# EAGLE design 405_led_jetracer010002 (EAGLE 9.6.2)
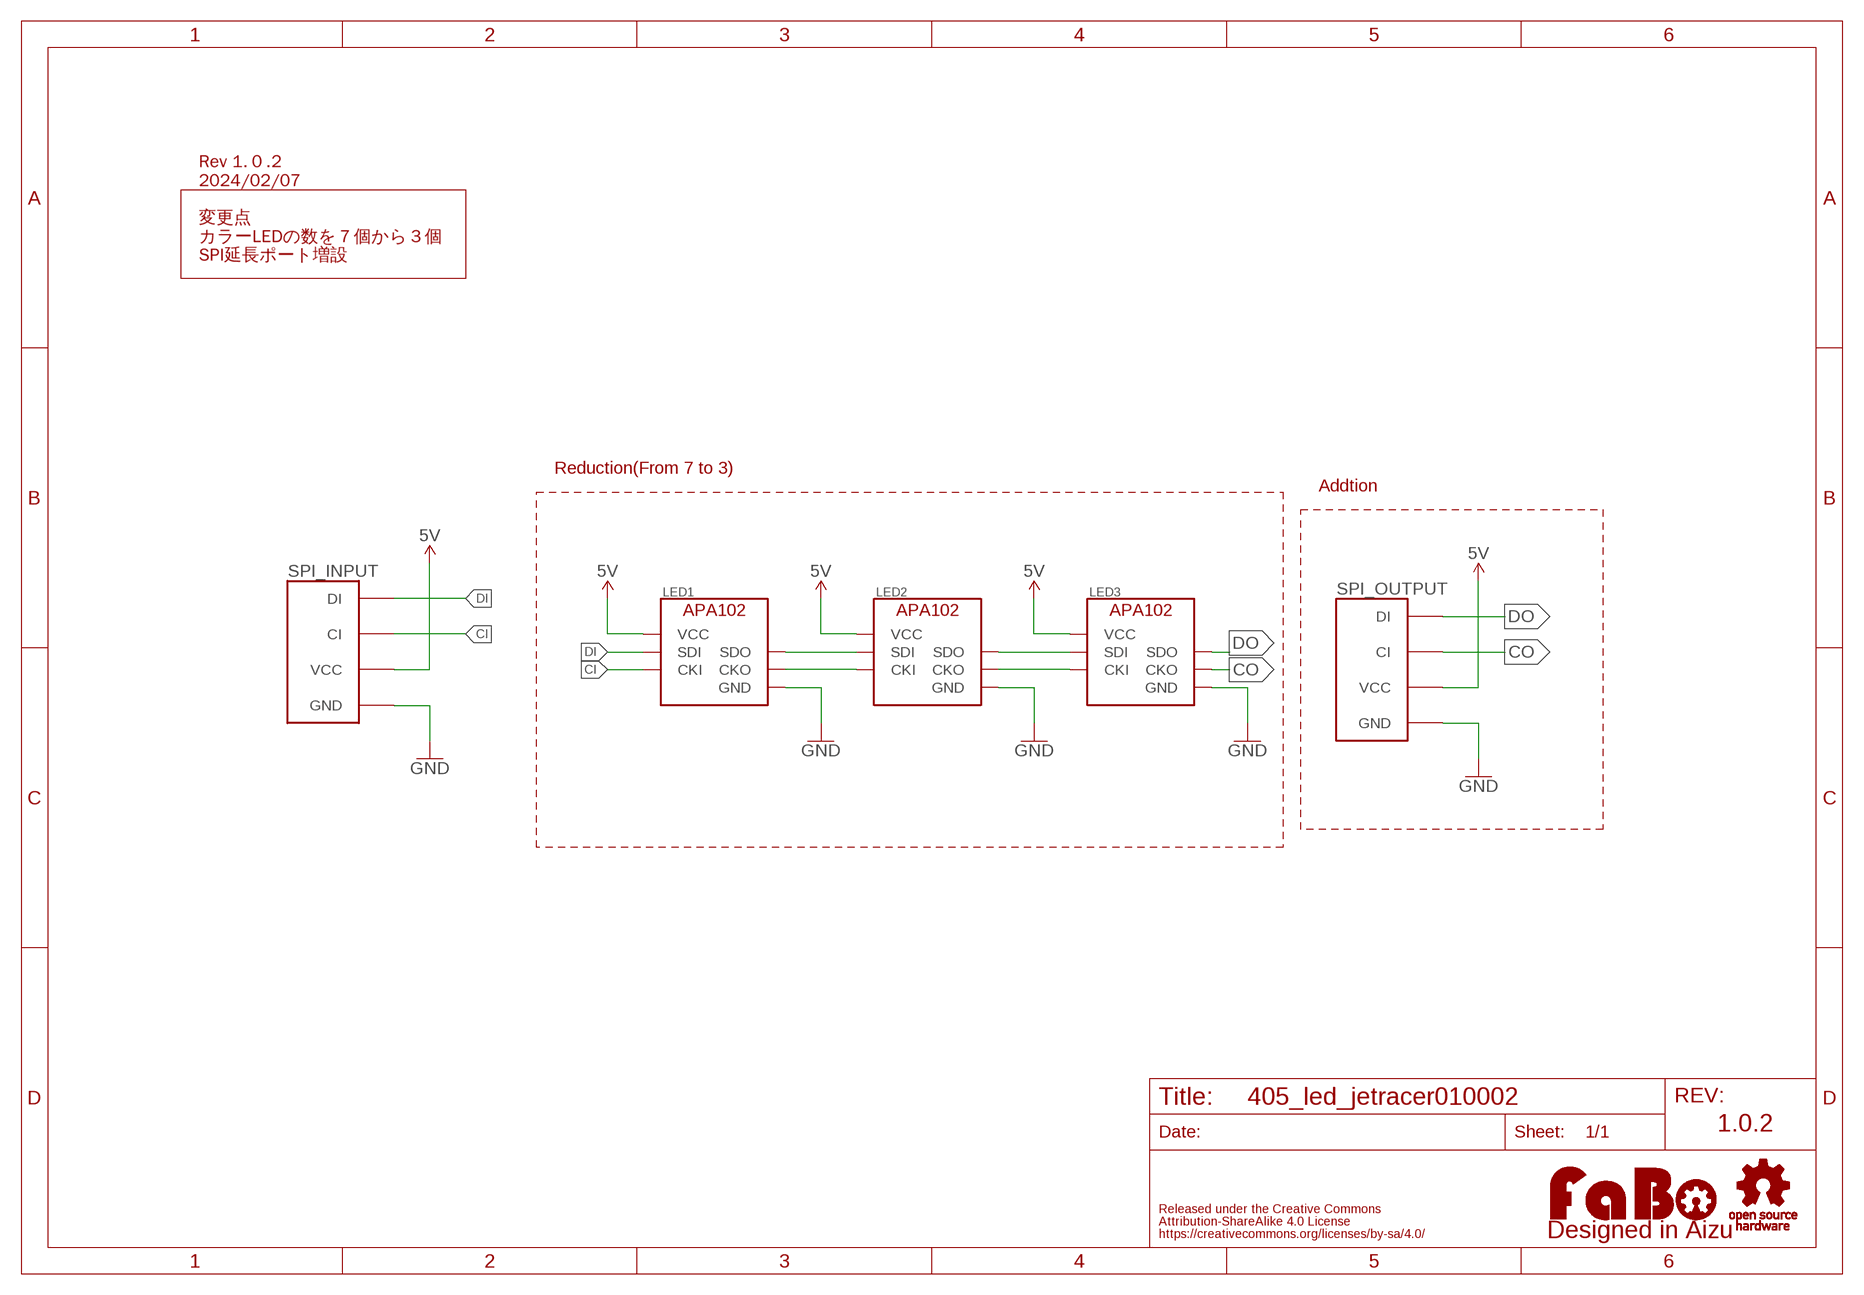
[diagram p0: schematic, sheet 1]

## Parts
LED1  APA102_IPIXEL  [APA102_2020]
LED2  APA102_IPIXEL  [APA102_2020]
LED3  APA102_IPIXEL  [APA102_2020]
LOGO1  LOGO_OSHW-S_BOTTOM  [LOGO_OSHW_S_BOTTOM]
LOGO2  LOGO_FABO-S  [LOGO_FABO_S]
SPI_INPUT  FABO-SPI-LED-B04B  [SPI-B04B-PASK-1]
SPI_OUTPUT  FABO-SPI-LED-B04B  [SPI-B04B-PASK-1]

## Nets
5V: LED1.VCC LED2.VCC LED3.VCC SPI_INPUT.VCC SPI_OUTPUT.VCC
CI: LED1.CKI SPI_INPUT.CI
CI1: LED1.CKO LED2.CKI
CI2: LED2.CKO LED3.CKI
CO: LED3.CKO SPI_OUTPUT.CI
DI: LED1.SDI SPI_INPUT.DI
DI1: LED1.SDO LED2.SDI
DI2: LED2.SDO LED3.SDI
DO: LED3.SDO SPI_OUTPUT.DI
GND: LED1.GND LED2.GND LED3.GND SPI_INPUT.GND SPI_OUTPUT.GND

## Notes on the sheet
- Rev 1.０.2
  2024/02/07
  
  変更点
  カラーLEDの数を７個から３個
  SPI延長ポート増設
- Reduction(From 7 to 3)
- Addtion
- 1.0.2

## Library data of the parts
LED1-LED3 = FaBo-LED:APA102
LOGO1 = FaBo-Logo:LOGO_OSHW
LOGO2 = FaBo-Logo:LOGO_FABO
SPI_INPUT SPI_OUTPUT = FaBo-Connetor:FABO-SPI-LED

## Board
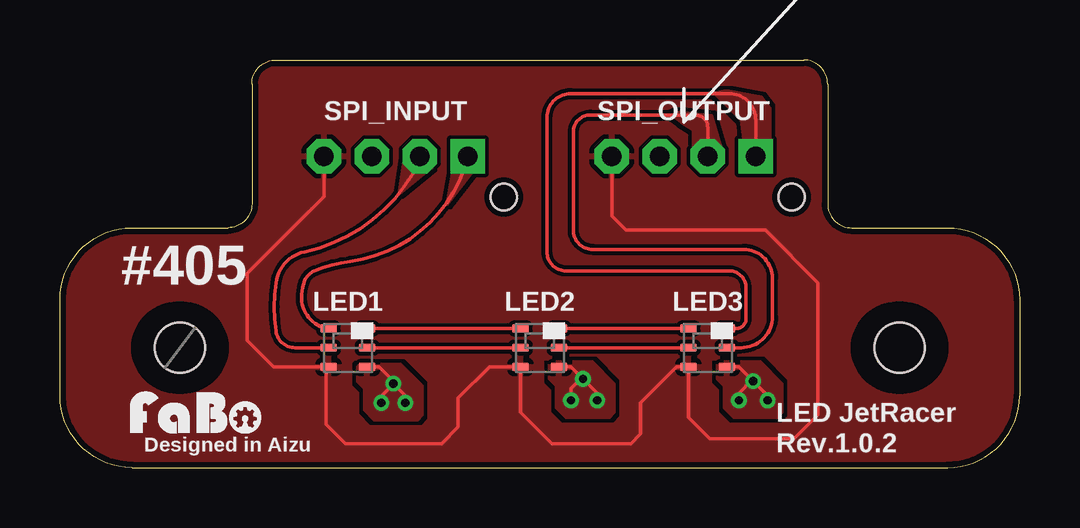
[diagram p1: board, top side]
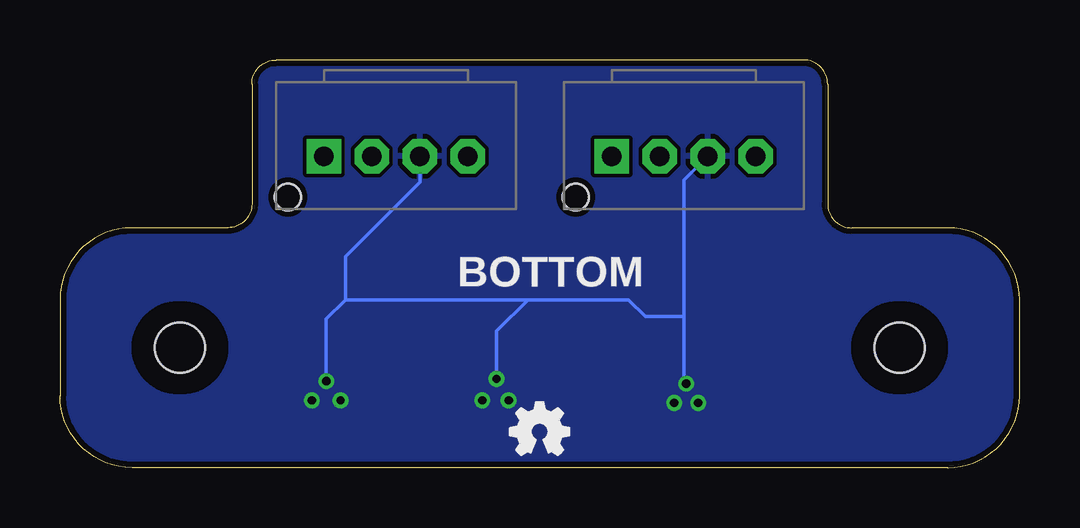
[diagram p2: board, bottom side, seen from below]

Size 40 x 17 mm. Coordinates in mm from the lower left corner, seen from the top.
Outline: 3,0 37,0 arc90 40,3 40,7 arc90 37,10 33,10 arc-90 32,11 32,16 arc90 31,17 9,17 arc90 8,16 8,11 arc-90 7,10 3,10 arc90 0,7 0,3 arc90 3,0
Copper layers (1*16): Top 0.035mm / dielectric 1.6mm / Bottom 0.035mm
Design rules "PCBway": minimum track width 6mil, minimum drill 12mil, track to track 6mil, track to pad 6mil, pad to pad 6mil, via to via 6mil, smd to smd 6mil, copper to edge 10mil, drill to drill 10mil, minimum pad ring 10mil, minimum via ring 6mil, stop-mask expansion 2mil, vias tented up to drill 100mil, thermal gap 8mil
Holes 2.1 mm at 5,5 35,5
tRestrict: area 3.2,3.3 to 6.8,6.7; area 33.2,3.3 to 36.8,6.7
bRestrict: area 3.2,3.3 to 6.8,6.7; area 33.2,3.3 to 36.8,6.7

### Footprints (pad centres in the part's own frame; a part is rotated, then mirrored left to right if it is on the bottom)
APA102_2020 = smd 0.7 x 0.35: CKI 0.8,0; CKO -0.8,0; GND 0.8,0.8; SDI 0.8,-0.8; SDO -0.8,-0.8; VCC -0.8,0.8
SPI-B04B-PASK-1 = drill 0.8 pad 1.422 octagon: CI 1,1.27; GND -3,1.27; VCC -1,1.27 | drill 0.8 pad 1.422 square: DI 3,1.27 | hole 1.1: 4.5,2.97

### Placement (x,y rotation side)
LED1  12,5 180 top
LED2  20,5 180 top
LED3  27,5 180 top
LOGO1  20,1.5 0 top
LOGO2  5.71,1.27 0 top
SPI_INPUT  14,14.25 180 bottom
SPI_OUTPUT  26,14.25 180 bottom

### Tracks (layer width: path | path; a pad name or v marks a point on that pad's centre or on a via)
5V  (via drill 0.35)
  Top 0.152: LED1.VCC 13.3,4.2 13.9,3.6 v13.9,3.5 | LED2.VCC 21.3,4.2 21.75,3.75 | 21.75,3.75 v21.8,3.7 22.4,3.1 v22.4,2.8 | LED3.VCC 28.3,4.2 28.85,3.65 | 28.85,3.65 v28.9,3.6 29.5,3 v29.5,2.8 | v13.4,2.7 13.4,3 v13.9,3.5 | v13.9,3.5 14.4,3 v14.4,2.7 | v21.3,2.8 21.3,3.3 21.75,3.75 | v28.3,2.8 28.3,3.1 28.85,3.65
  Bottom 0.152: SPI_INPUT.VCC 14,11.98 14,6.3 | 14,6.3 14,3.6 v13.9,3.5 | 14,6.3 15.6,6.3 16.3,7 20.5,7 | 20.5,7 21.8,5.7 v21.8,3.7 | 20.5,7 28.1,7 | 28.1,7 28.9,6.2 v28.9,3.6 | SPI_OUTPUT.VCC 25,11.9 28.1,8.8 28.1,7
  pour Bottom (isolate 0.152, rank 3): -2.5,-1.8 42.6,-1.8 42.6,19.4 -2.5,19.4
  pour Top: 12.7,2.4 12.7,3.3 12.4,3.6 12.4,4.2 12.5,4.3 14.2,4.3 15.1,3.4 15.1,2.2 14.9,2 13.1,2
  pour Top: 20.7,2.5 20.7,3.4 20.4,3.7 20.4,4.3 20.5,4.4 22.2,4.4 23.1,3.5 23.1,2.3 22.9,2.1 21.1,2.1
  pour Top: 27.7,2.5 27.7,3.4 27.4,3.7 27.4,4.3 27.5,4.4 29.2,4.4 30.1,3.5 30.1,2.3 29.9,2.1 28.1,2.1
CI
  Top 0.152: SPI_INPUT.CI 15,12.8 arc-52 10.2,9 arc70 9,7.7 arc15 9,5.7 arc82 9.8,5 LED1.CKI
  pour Top (no thermals): 14.13,11.41 14.4,13.2 14.8,13.6 15.2,13.6 15.5,13.3 15.5,12.54
CI1
  Top 0.152: LED1.CKO LED2.CKI
CI2
  Top 0.152: LED2.CKO LED3.CKI
CO
  Top 0.152: LED3.CKO 28.4,5 arc90 29.7,6.3 29.7,7.9 arc90 28.5,9.1 22.2,9.1 arc-90 21.4,9.9 21.4,14 arc-90 22.1,14.7 26.5,14.7 | 26.5,14.7 26.6,14.7 | 26.5,14.7 arc-90 27,14.2 SPI_OUTPUT.CI
  pour Top (no thermals): 26.4,12.8 26.4,14.1 25.9,14.4 25.5,14.7 25.81,14.83 27.16,14.68 27.6,13.2 27.6,12.8 27.2,12.6 26.7,12.6
DI
  Top 0.152: LED1.SDI arc-76 10.08,6.92 arc-29 10.2,7.8 arc-45 10.6,8.2 arc-15 12.1,8.6 arc68 SPI_INPUT.DI
  pour Top (no thermals): 16.13,10.97 16.56,13.29 17.47,13.38 17.63,12.91
DI1
  Top 0.152: LED1.SDO LED2.SDI
DI2
  Top 0.152: LED2.SDO LED3.SDI
DO
  Top 0.152: SPI_OUTPUT.DI 29,14.5 arc90 27.9,15.6 21.3,15.6 arc90 20.3,14.6 20.3,9 arc90 21.1,8.2 27.9,8.2 arc-90 28.6,7.5 28.6,6.2 arc-90 28.2,5.8 LED3.SDO
  pour Top (no thermals): 28.66,12.58 28.4,14.5 27.28,15.62 27.77,15.71 29.24,15.45 29.6,15 29.6,12.83 29.4,12.5 28.72,12.5
GND
  Top 0.152: SPI_INPUT.GND 11,11.3 7.8,8.1 7.8,5.3 8.9,4.2 LED1.GND 11.1,4.1 11.1,1.8 11.9,1 15.9,1 16.6,1.7 16.6,2.9 17.9,4.2 LED2.GND 19.2,2.3 20.5,1 23.8,1 24.2,1.4 24.2,2.7 25.7,4.2 LED3.GND 26.2,2.1 27.1,1.2 30.6,1.2 31.6,2.2 31.6,7.7 29.4,9.9 23.6,9.9 23,10.5 SPI_OUTPUT.GND
  pour Top (isolate 0.152, rank 3): -1,-1.1 41.1,-1.1 41.1,17.8 -1,17.8

### Text on the board
tPlace: #405 | LED JetRacer | Designed in Aizu | Rev.1.0.2
bPlace: BOTTOM
Document: TopLayer GND / BottomLayer 5V | #405 LED JetRacer / Revision 1.0.2 / 2024/02/15
_tNames: Users Option